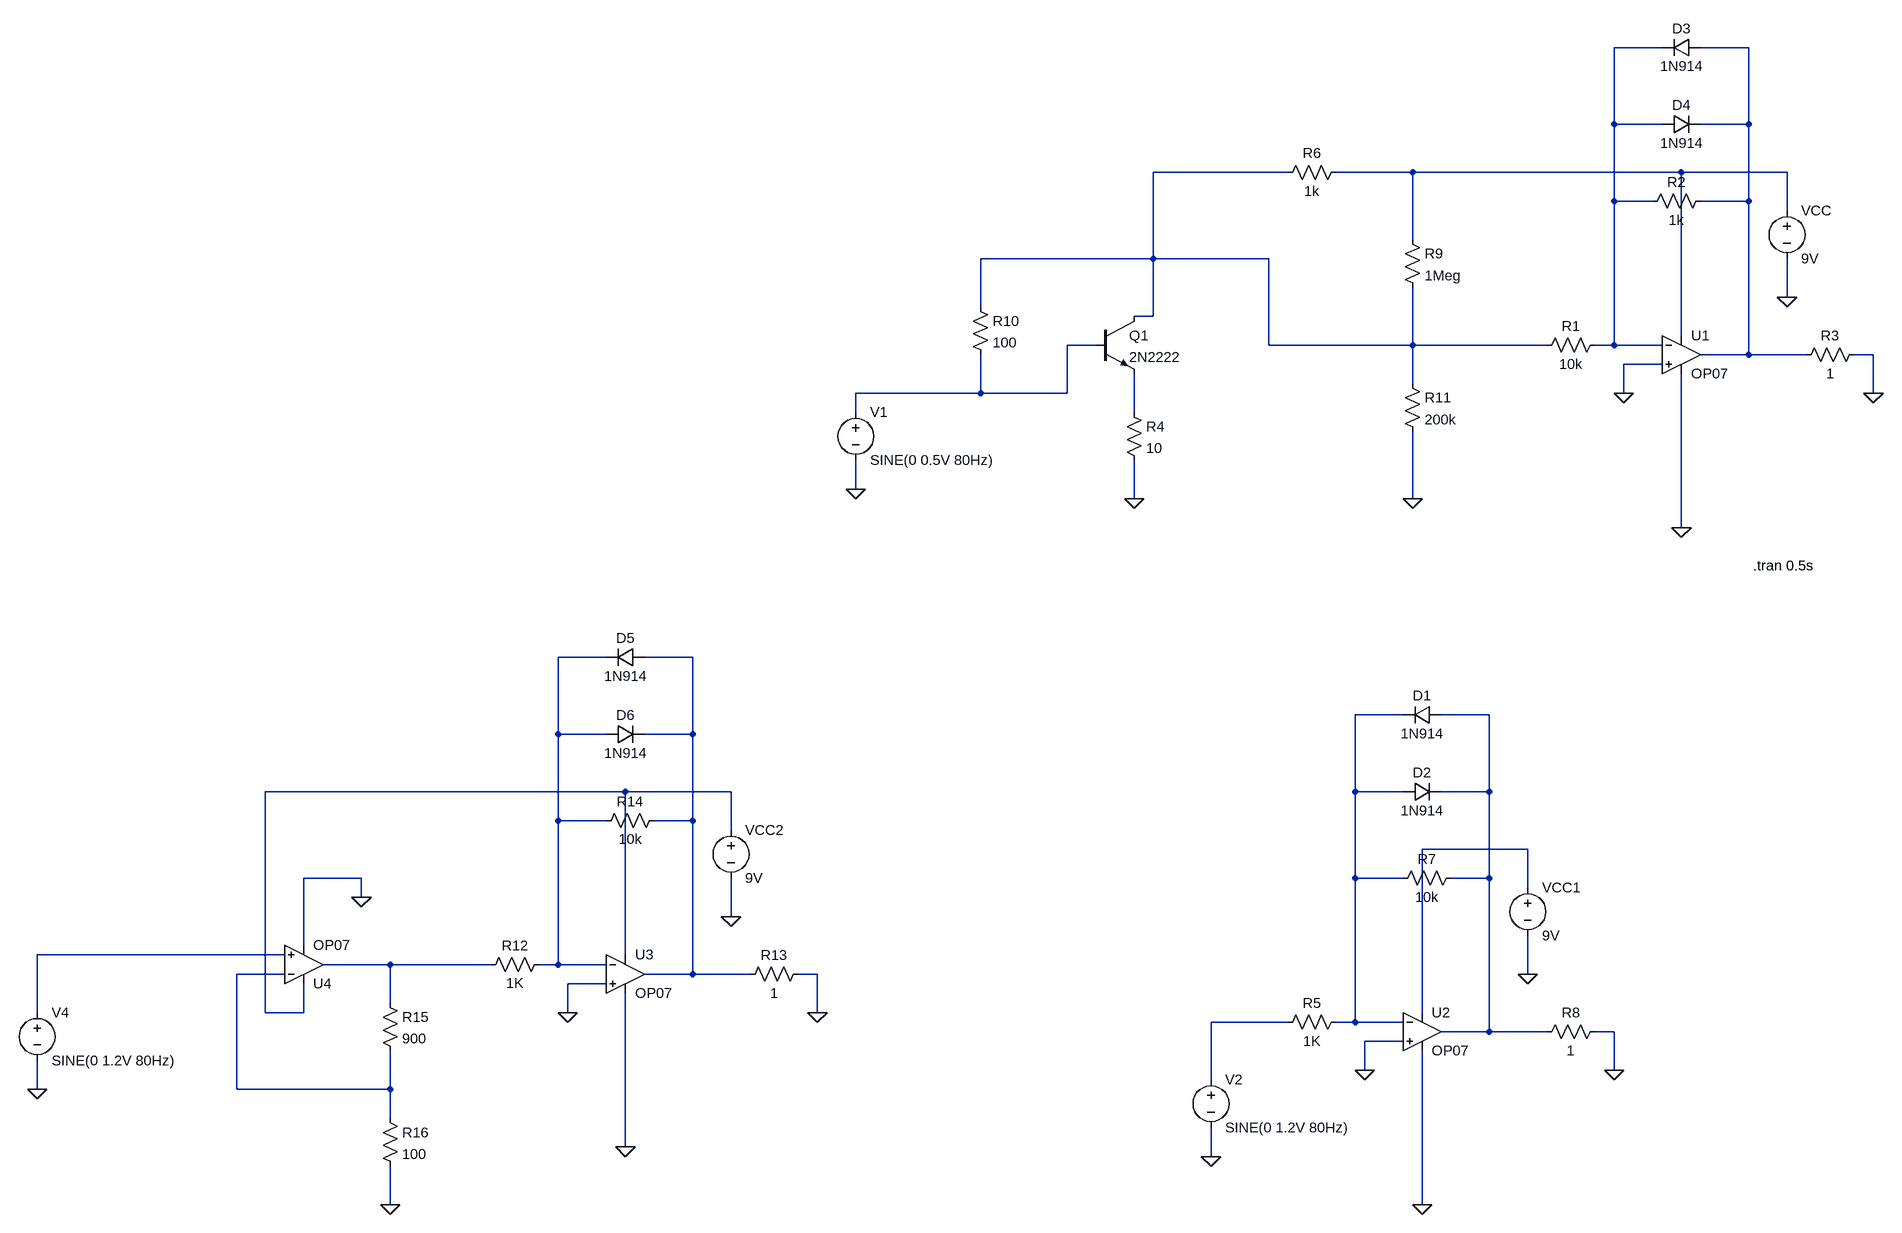
[diagram p0: schematic triggerSchmittFuzz-trialAndError.asc]
triggerSchmittFuzz-trialAndError.asc, the LTspice schematic file:
Version 4.1
SHEET 1 880 1620
WIRE -32 -400 -112 -400
WIRE 112 -400 32 -400
WIRE -112 -272 -112 -400
WIRE -32 -272 -112 -272
WIRE 112 -272 112 -400
WIRE 112 -272 32 -272
WIRE -656 -192 -880 -192
WIRE -448 -192 -576 -192
WIRE 0 -192 -448 -192
WIRE 176 -192 0 -192
WIRE -112 -144 -112 -272
WIRE -48 -144 -112 -144
WIRE 112 -144 112 -272
WIRE 112 -144 32 -144
WIRE 176 -128 176 -192
WIRE -448 -80 -448 -192
WIRE -880 -48 -880 -192
WIRE -880 -48 -1168 -48
WIRE -688 -48 -880 -48
WIRE 176 16 176 -48
WIRE -1168 32 -1168 -48
WIRE -880 48 -880 -48
WIRE -880 48 -912 48
WIRE 0 80 0 -192
WIRE -976 96 -1024 96
WIRE -688 96 -688 -48
WIRE -448 96 -448 0
WIRE -448 96 -688 96
WIRE -224 96 -448 96
WIRE -112 96 -112 -144
WIRE -112 96 -144 96
WIRE -32 96 -112 96
WIRE 112 112 112 -144
WIRE 112 112 32 112
WIRE 208 112 112 112
WIRE 320 112 288 112
WIRE -32 128 -96 128
WIRE -448 160 -448 96
WIRE -1168 176 -1168 112
WIRE -1168 176 -1376 176
WIRE -1024 176 -1024 96
WIRE -1024 176 -1168 176
WIRE -96 176 -96 128
WIRE 320 176 320 112
WIRE -1376 208 -1376 176
WIRE -912 208 -912 144
WIRE -1376 336 -1376 288
WIRE -912 352 -912 288
WIRE -448 352 -448 240
WIRE 0 400 0 144
WIRE -1792 688 -1872 688
WIRE -1648 688 -1728 688
WIRE -464 784 -544 784
WIRE -320 784 -400 784
WIRE -1872 816 -1872 688
WIRE -1792 816 -1872 816
WIRE -1648 816 -1648 688
WIRE -1648 816 -1728 816
WIRE -1760 912 -2560 912
WIRE -1584 912 -1760 912
WIRE -544 912 -544 784
WIRE -464 912 -544 912
WIRE -320 912 -320 784
WIRE -320 912 -400 912
WIRE -1872 960 -1872 816
WIRE -1792 960 -1872 960
WIRE -1648 960 -1648 816
WIRE -1648 960 -1712 960
WIRE -1584 976 -1584 912
WIRE -256 1008 -432 1008
WIRE -2400 1056 -2496 1056
WIRE -544 1056 -544 912
WIRE -464 1056 -544 1056
WIRE -320 1056 -320 912
WIRE -320 1056 -384 1056
WIRE -256 1072 -256 1008
WIRE -2400 1088 -2400 1056
WIRE -1584 1120 -1584 1056
WIRE -2496 1168 -2496 1056
WIRE -2528 1184 -3072 1184
WIRE -1760 1184 -1760 912
WIRE -2352 1200 -2464 1200
WIRE -1984 1200 -2352 1200
WIRE -1872 1200 -1872 960
WIRE -1872 1200 -1904 1200
WIRE -1792 1200 -1872 1200
WIRE -2528 1216 -2608 1216
WIRE -1648 1216 -1648 960
WIRE -1648 1216 -1728 1216
WIRE -1552 1216 -1648 1216
WIRE -1440 1216 -1472 1216
WIRE -256 1216 -256 1152
WIRE -1792 1232 -1856 1232
WIRE -2352 1264 -2352 1200
WIRE -3072 1280 -3072 1184
WIRE -2560 1280 -2560 912
WIRE -2496 1280 -2496 1232
WIRE -2496 1280 -2560 1280
WIRE -1856 1280 -1856 1232
WIRE -1440 1280 -1440 1216
WIRE -432 1280 -432 1008
WIRE -656 1296 -784 1296
WIRE -544 1296 -544 1056
WIRE -544 1296 -576 1296
WIRE -464 1296 -544 1296
WIRE -320 1312 -320 1056
WIRE -320 1312 -400 1312
WIRE -224 1312 -320 1312
WIRE -112 1312 -144 1312
WIRE -464 1328 -528 1328
WIRE -528 1376 -528 1328
WIRE -112 1376 -112 1312
WIRE -784 1392 -784 1296
WIRE -3072 1408 -3072 1360
WIRE -2608 1408 -2608 1216
WIRE -2352 1408 -2352 1344
WIRE -2352 1408 -2608 1408
WIRE -2352 1456 -2352 1408
WIRE -1760 1504 -1760 1248
WIRE -784 1520 -784 1472
WIRE -2352 1600 -2352 1536
WIRE -432 1600 -432 1344
FLAG 0 400 0
FLAG 176 16 0
FLAG -96 176 0
FLAG -1376 336 0
FLAG 320 176 0
FLAG -912 352 0
FLAG -432 1600 0
FLAG -256 1216 0
FLAG -528 1376 0
FLAG -112 1376 0
FLAG -784 1520 0
FLAG -448 352 0
FLAG -1760 1504 0
FLAG -1584 1120 0
FLAG -1856 1280 0
FLAG -1440 1280 0
FLAG -3072 1408 0
FLAG -2400 1088 0
FLAG -2352 1600 0
SYMBOL OpAmps\\OP07 0 48 R0
SYMATTR InstName U1
SYMBOL voltage 176 -144 R0
SYMATTR InstName VCC
SYMATTR Value 9V
SYMBOL voltage -1376 192 R0
WINDOW 123 0 0 Left 0
WINDOW 39 0 0 Left 0
SYMATTR InstName V1
SYMATTR Value SINE(0 0.5V 80Hz)
SYMBOL res -128 80 R90
WINDOW 0 0 56 VBottom 2
WINDOW 3 32 56 VTop 2
SYMATTR InstName R1
SYMATTR Value 10k
SYMBOL res 304 96 R90
WINDOW 0 0 56 VBottom 2
WINDOW 3 32 56 VTop 2
SYMATTR InstName R3
SYMATTR Value 1
SYMBOL npn -976 48 R0
SYMATTR InstName Q1
SYMATTR Value 2N2222
SYMBOL res -928 192 R0
SYMATTR InstName R4
SYMATTR Value 10
SYMBOL res -560 -208 R90
WINDOW 0 0 56 VBottom 2
WINDOW 3 32 56 VTop 2
SYMATTR InstName R6
SYMATTR Value 1k
SYMBOL OpAmps\\OP07 -432 1248 R0
SYMATTR InstName U2
SYMBOL voltage -256 1056 R0
SYMATTR InstName VCC1
SYMATTR Value 9V
SYMBOL res -560 1280 R90
WINDOW 0 0 56 VBottom 2
WINDOW 3 32 56 VTop 2
SYMATTR InstName R5
SYMATTR Value 1K
SYMBOL res -128 1296 R90
WINDOW 0 0 56 VBottom 2
WINDOW 3 32 56 VTop 2
SYMATTR InstName R8
SYMATTR Value 1
SYMBOL voltage -784 1376 R0
WINDOW 123 0 0 Left 0
WINDOW 39 0 0 Left 0
SYMATTR InstName V2
SYMATTR Value SINE(0 1.2V 80Hz)
SYMBOL diode -400 768 R90
WINDOW 0 0 32 VBottom 2
WINDOW 3 32 32 VTop 2
SYMATTR InstName D1
SYMATTR Value 1N914
SYMBOL diode -464 928 R270
WINDOW 0 32 32 VTop 2
WINDOW 3 0 32 VBottom 2
SYMATTR InstName D2
SYMATTR Value 1N914
SYMBOL res -368 1040 R90
WINDOW 0 0 56 VBottom 2
WINDOW 3 32 56 VTop 2
SYMATTR InstName R7
SYMATTR Value 10k
SYMBOL diode 32 -416 R90
WINDOW 0 0 32 VBottom 2
WINDOW 3 32 32 VTop 2
SYMATTR InstName D3
SYMATTR Value 1N914
SYMBOL diode -32 -256 R270
WINDOW 0 32 32 VTop 2
WINDOW 3 0 32 VBottom 2
SYMATTR InstName D4
SYMATTR Value 1N914
SYMBOL res 48 -160 R90
WINDOW 0 0 56 VBottom 2
WINDOW 3 32 56 VTop 2
SYMATTR InstName R2
SYMATTR Value 1k
SYMBOL res -1184 16 R0
SYMATTR InstName R10
SYMATTR Value 100
SYMBOL res -464 -96 R0
SYMATTR InstName R9
SYMATTR Value 1Meg
SYMBOL res -464 144 R0
SYMATTR InstName R11
SYMATTR Value 200k
SYMBOL OpAmps\\OP07 -1760 1152 R0
SYMATTR InstName U3
SYMBOL voltage -1584 960 R0
SYMATTR InstName VCC2
SYMATTR Value 9V
SYMBOL res -1888 1184 R90
WINDOW 0 0 56 VBottom 2
WINDOW 3 32 56 VTop 2
SYMATTR InstName R12
SYMATTR Value 1K
SYMBOL res -1456 1200 R90
WINDOW 0 0 56 VBottom 2
WINDOW 3 32 56 VTop 2
SYMATTR InstName R13
SYMATTR Value 1
SYMBOL diode -1728 672 R90
WINDOW 0 0 32 VBottom 2
WINDOW 3 32 32 VTop 2
SYMATTR InstName D5
SYMATTR Value 1N914
SYMBOL diode -1792 832 R270
WINDOW 0 32 32 VTop 2
WINDOW 3 0 32 VBottom 2
SYMATTR InstName D6
SYMATTR Value 1N914
SYMBOL res -1696 944 R90
WINDOW 0 0 56 VBottom 2
WINDOW 3 32 56 VTop 2
SYMATTR InstName R14
SYMATTR Value 10k
SYMBOL voltage -3072 1264 R0
WINDOW 123 0 0 Left 0
WINDOW 39 0 0 Left 0
SYMATTR InstName V4
SYMATTR Value SINE(0 1.2V 80Hz)
SYMBOL OpAmps\\OP07 -2496 1264 M180
SYMATTR InstName U4
SYMBOL res -2368 1248 R0
SYMATTR InstName R15
SYMATTR Value 900
SYMBOL res -2368 1440 R0
SYMATTR InstName R16
SYMATTR Value 100
TEXT 120 464 Left 2 !.tran 0.5s

The netlist it stands for:
* triggerSchmittFuzz-trialAndError.asc
X§U1 0 N001 N004 0 N002 LT1001  ; OP07, pins In+ In- V+ V- OUT
VCC N004 0 9V
V1 N005 0 SINE(0 0.5V 80Hz)
R1 N001 N003 10k
R3 0 N002 1
Q1 N003 N005 N006 0 2N2222
R4 N006 0 10
R6 N004 N003 1k
X§U2 0 N009 N012 0 N010 LT1001  ; OP07, pins In+ In- V+ V- OUT
VCC1 N012 0 9V
R5 N009 N016 1K
R8 0 N010 1
V2 N016 0 SINE(0 1.2V 80Hz)
D1 N010 N009 1N914
D2 N009 N010 1N914
R7 N010 N009 10k
D3 N002 N001 1N914
D4 N001 N002 1N914
R2 N002 N001 1k
R10 N003 N005 100
R9 N004 N003 1Meg
R11 N003 0 200k
X§U3 0 N007 N011 0 N008 LT1001  ; OP07, pins In+ In- V+ V- OUT
VCC2 N011 0 9V
R12 N007 N014 1K
R13 0 N008 1
D5 N008 N007 1N914
D6 N007 N008 1N914
R14 N008 N007 10k
V4 N013 0 SINE(0 1.2V 80Hz)
X§U4 N013 N015 N011 0 N014 LT1001  ; OP07, pins In+ In- V+ V- OUT
R15 N014 N015 900
R16 N015 0 100
.model D D
.lib standard.dio
.model NPN NPN
.model PNP PNP
.lib standard.bjt
.tran 0.5s
.lib LTC.lib
.backanno
.end